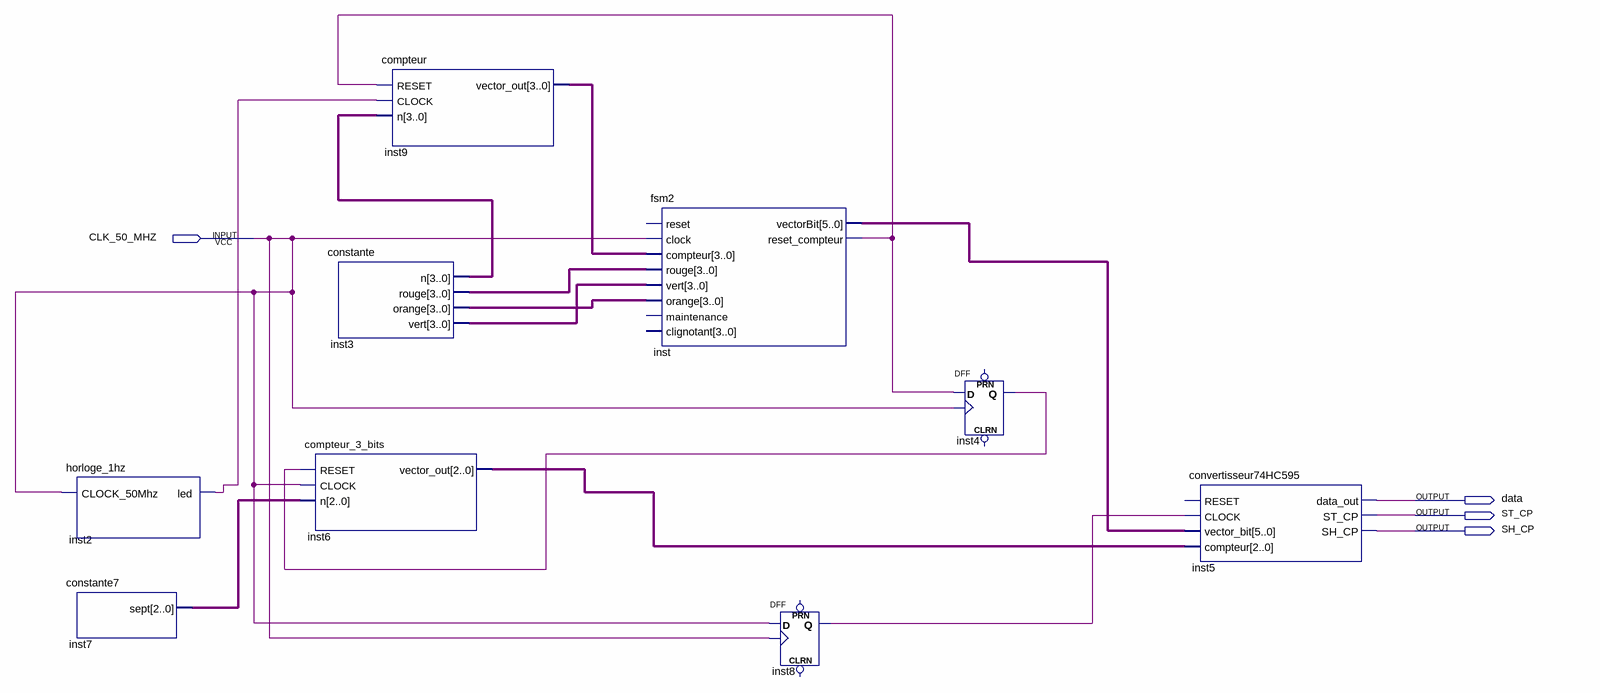
[diagram p0: schematic sheet]
// Quartus schematic testUnit74HC595.bdf as structural Verilog: 9 symbols, 4 pins
module testUnit74HC595 (
  input  CLK_50_MHZ,
  output data,
  output ST_CP,
  output SH_CP
);

  wire inst2_led, inst4_q, inst8_q, inst_reset_compteur;
  wire [2:0] inst6_vector_out, inst7_sept;
  wire [3:0] inst3_n, inst3_orange, inst3_rouge, inst3_vert, inst9_vector_out;
  wire [5:0] inst_vectorbit;

  horloge_1hz inst2 (.CLOCK_50Mhz(CLK_50_MHZ), .led(inst2_led));
  constante7 inst7 (.sept(inst7_sept));
  constante inst3 (.n(inst3_n), .rouge(inst3_rouge), .orange(inst3_orange), .vert(inst3_vert));
  compteur_3_bits inst6 (.RESET(inst4_q), .CLOCK(CLK_50_MHZ), .n(inst7_sept), .vector_out(inst6_vector_out));
  compteur inst9 (.RESET(inst_reset_compteur), .CLOCK(inst2_led), .n(inst3_n), .vector_out(inst9_vector_out));
  fsm2 inst (
    .clock(CLK_50_MHZ), .compteur(inst9_vector_out), .rouge(inst3_rouge), .vert(inst3_vert),
    .orange(inst3_orange), .vectorBit(inst_vectorbit), .reset_compteur(inst_reset_compteur));  // open: reset, maintenance, clignotant
  DFF inst8 (.CLK(CLK_50_MHZ), .D(CLK_50_MHZ), .Q(inst8_q));  // open: CLRN, PRN
  DFF inst4 (.CLK(CLK_50_MHZ), .D(inst_reset_compteur), .Q(inst4_q));  // open: CLRN, PRN
  convertisseur74HC595 inst5 (
    .CLOCK(inst8_q), .vector_bit(inst_vectorbit), .compteur(inst6_vector_out), .data_out(data),
    .ST_CP(ST_CP), .SH_CP(SH_CP));  // open: RESET
endmodule
